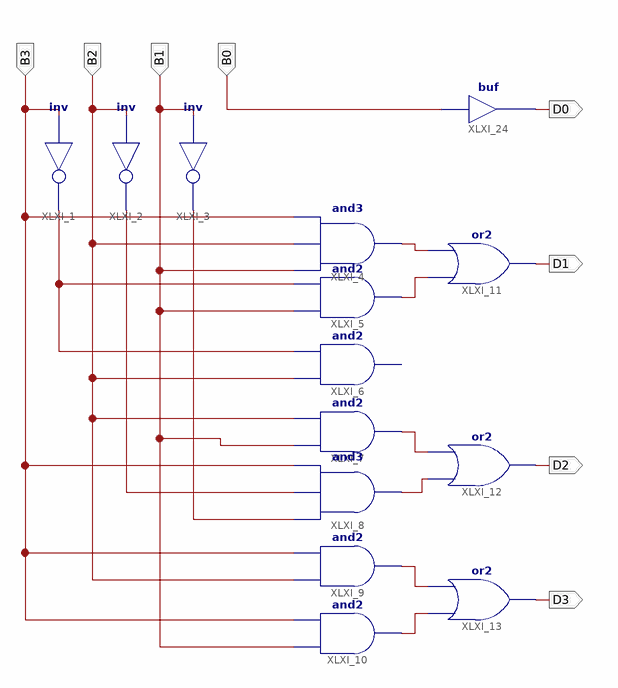
[diagram p0: schematic sheet 1]
// Xilinx ISE schematic binary_to_7segment.sch (spartan6) as structural Verilog: 14 symbols, 8 ports
module binary_to_7segment (
  input  B3,
  input  B2,
  input  B1,
  input  B0,
  output D1,
  output D2,
  output D3,
  output D0
);

  wire XLXN_12, XLXN_13, XLXN_14, XLXN_22, XLXN_23, XLXN_24, XLXN_25, XLXN_26, XLXN_27;

  not XLXI_1 (XLXN_12, B3);
  not XLXI_2 (XLXN_13, B2);
  not XLXI_3 (XLXN_14, B1);
  and XLXI_5 (XLXN_23, B1, XLXN_12);
  and XLXI_4 (XLXN_22, B1, B2, B3);
  // and2 XLXI_6 has open pins: I0=B2, I1=XLXN_12, O=open
  and XLXI_7 (XLXN_24, B1, B2);
  and XLXI_9 (XLXN_26, B2, B3);
  and XLXI_10 (XLXN_27, B1, B3);
  or XLXI_11 (D1, XLXN_23, XLXN_22);
  or XLXI_12 (D2, XLXN_25, XLXN_24);
  or XLXI_13 (D3, XLXN_27, XLXN_26);
  and XLXI_8 (XLXN_25, XLXN_14, XLXN_13, B3);
  buf XLXI_24 (D0, B0);
endmodule
